# Altium project Little_Drone.PrjPcb
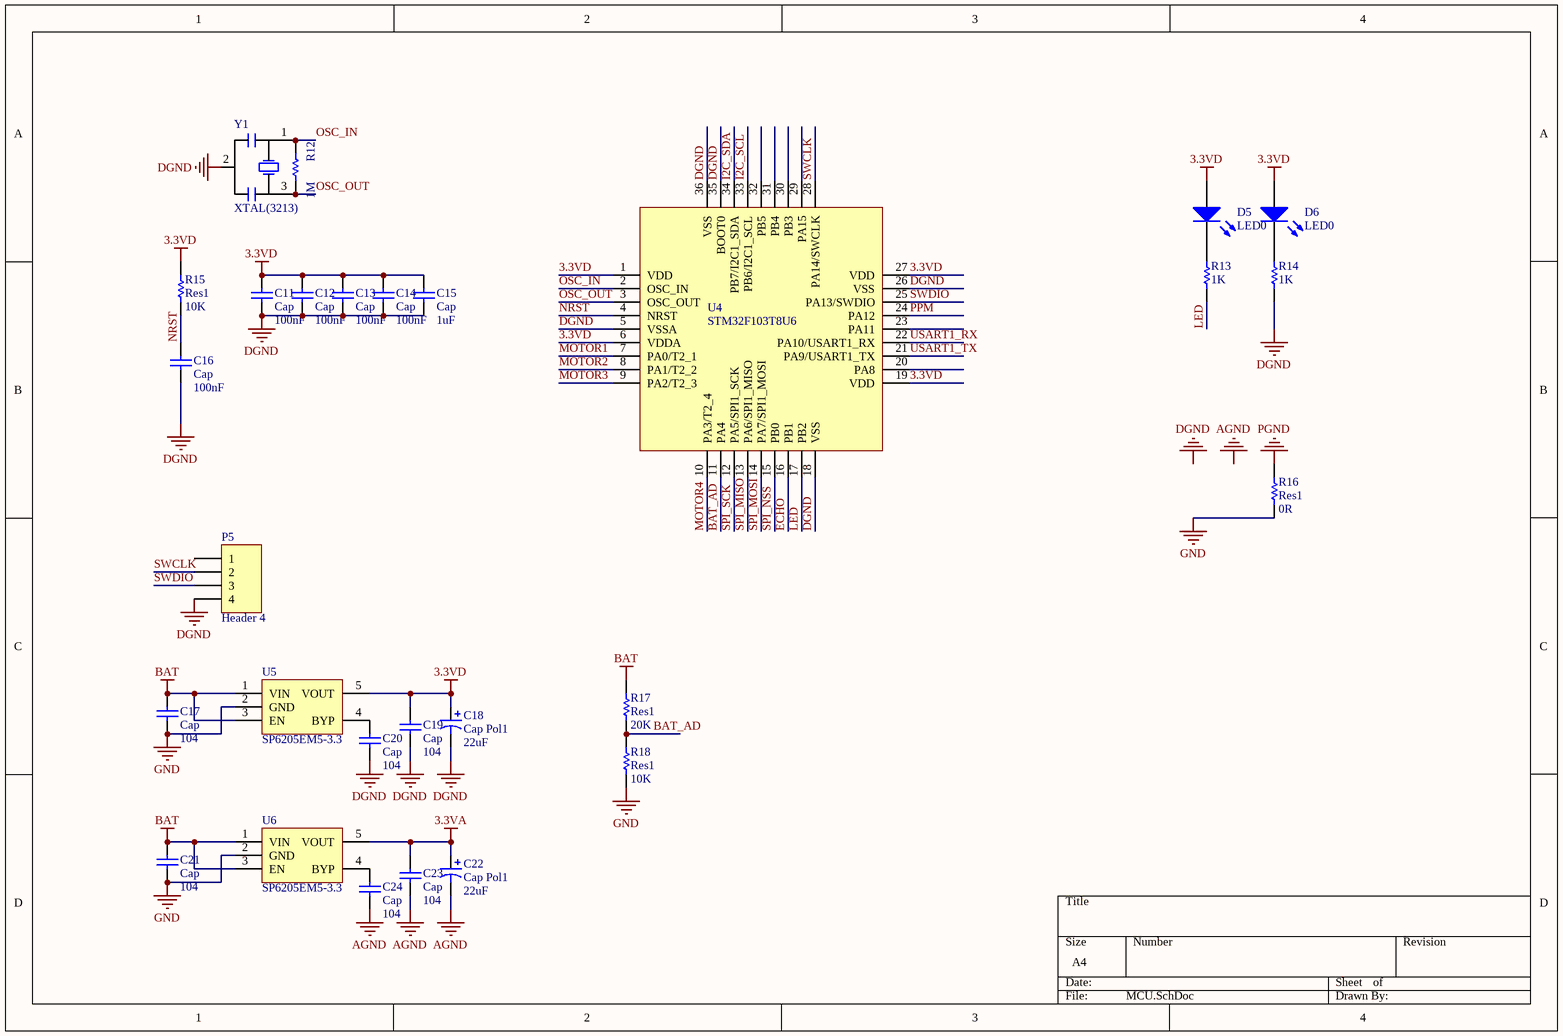
[diagram p0: MCU.SchDoc]
2 sheets, 64 parts. Net scope: global (net labels, ports and power ports of the same name join across sheets).
Board file: PCB.PcbDoc
Sheets:
  MCU.SchDoc
  MOTOR.SchDoc

## Sheet MCU.SchDoc
size A4

### Parts
(Parts that share a designator on the sheet are numbered #1, #2 ... from top to bottom, then left to right.)
C11  Cap  value 100nF  [C0402]
C12  Cap  value 100nF  [C0402]
C13  Cap  value 100nF  [C0402]
C14  Cap  value 100nF  [C0402]
C15  Cap  value 1uF  [C0402]
C16  Cap  value 100nF  [C0402]
C17  Cap  value 104  [C0603]
C18  Cap Pol1  value 22uF  [C0805]
C19  Cap  value 104  [C0402]
C20  Cap  value 104  [C0402]
C21  Cap  value 104  [C0603]
C22  Cap Pol1  value 22uF  [C0805]
C23#1  Cap  value 104  [C0402]
C24#1  Cap  value 104  [C0402]
D5#1  LED0  [0603D]
D6#1  LED0  [0603D]
P5  Header 4  [1.0*4PIN/SMD]
R12  value 1M  [R0402]  (hidden comment: Res1)
R13  value 1K  [R0603]  (hidden comment: Res1)
R14  value 1K  [R0603]  (hidden comment: Res1)
R15#1  Res1  value 10K  [R0402]
R16#1  Res1  value 0R  [0805R]
R17#1  Res1  value 20K  [R0402]
R18#1  Res1  value 10K  [R0402]
U4  STM32F103T8U6  [VFQFPN36]
U5  SP6205EM5-3.3  [SOT-23-5]
U6  SP6205EM5-3.3  [SOT-23-5]
Y1  XTAL(3213)  [Y3213]

### Nets
3.3VA: C22.1 C23#1.2 U6.5(VOUT)
3.3VD: C11.2 C12.2 C13.2 C14.2 C15.2 C18.1 C19.2 D5#1.1(A) D6#1.1(A) R15#1.2 U4.1(VDD) U4.6(VDDA) U4.19(VDD) U4.27(VDD) U5.5(VOUT)
AGND: C22.2 C23#1.1 C24#1.1
BAT: C17.2 C21.2 R17#1.2 U5.1(VIN) U5.3(EN) U6.1(VIN) U6.3(EN)
DGND: C11.1 C12.1 C13.1 C14.1 C15.1 C16.1 C18.2 C19.1 C20.1 P5.4 R14.2 U4.5(VSSA) U4.18(VSS) U4.26(VSS) U4.35(BOOT0) U4.36(VSS) Y1.2(GND)
GND: C17.1 C21.1 R16#1.1 R18#1.1 U5.2(GND) U6.2(GND)
PGND: R16#1.2
BAT_AD: R17#1.1 R18#1.2 U4.11(PA4)
ECHO: U4.16(PB1)
I2C_SCL: U4.33(PB6/I2C1_SCL)
I2C_SDA: U4.34(PB7/I2C1_SDA)
LED: R13.2 U4.17(PB2)
MOTOR1: U4.7(PA0/T2_1)
MOTOR2: U4.8(PA1/T2_2)
MOTOR3: U4.9(PA2/T2_3)
MOTOR4: U4.10(PA3/T2_4)
NRST: C16.2 R15#1.1 U4.4(NRST)
OSC_IN: R12.2 U4.2(OSC_IN) Y1.1(OSC1)
OSC_OUT: R12.1 U4.3(OSC_OUT) Y1.3(OSC2)
PPM: U4.24(PA12)
SPI_MISO: U4.13(PA6/SPI1_MISO)
SPI_MOSI: U4.14(PA7/SPI1_MOSI)
SPI_NSS: U4.15(PB0)
SPI_SCK: U4.12(PA5/SPI1_SCK)
SWCLK: P5.2 U4.28(PA14/SWCLK)
SWDIO: P5.3 U4.25(PA13/SWDIO)
USART1_RX: U4.22(PA10/USART1_RX)
USART1_TX: U4.21(PA9/USART1_TX)
NetC20_2: C20.2 U5.4(BYP)
NetC24#1_2: C24#1.2 U6.4(BYP)
NetD5#1_2: D5#1.2(K) R13.1
NetD6#1_2: D6#1.2(K) R14.1

Not connected (* = marked no-connect by the designer): P5 1; U4 20(PA8) 23(PA11) 29(PA15) 30(PB3) 31(PB4) 32(PB5)

### Notes on the sheet
- Labels drawn without touching a wire or pin: AGND, DGND

### Library data of the parts
C11-C17 C19-C21 C23#1 C24#1 = Cap: Capacitor; Published: 8-Jun-2000; LatestRevisionDate: 17-Jul-2002; LatestRevisionNote: Re-released for DXP Platform.; PackageReference: RAD-0.3; Publisher: Altium Limited
C18 C22 = Cap Pol1: Polarized Capacitor (Radial); Published: 8-Jun-2000; LatestRevisionDate: 17-Jul-2002; LatestRevisionNote: Re-released for DXP Platform.; PackageReference: RB7.6-15; Publisher: Altium Limited
D5#1 D6#1 = LED0: Typical INFRARED GaAs LED; Published: 8-Jun-2000; LatestRevisionDate: 08-Jul-2005; LatestRevisionNote: Mech Layer 1 removed.; PackageReference: LED-0; Publisher: Altium Limited; PackageDescription: LED; 2 Leads
P5 = Header 4: Header, 4-Pin; LatestRevisionDate: 17-Jul-2002; LatestRevisionNote: Re-released for DXP Platform.; Publisher: Altium Limited
R12-R14 R15#1 R16#1 R17#1 R18#1 = Res1: Resistor; Published: 8-Jun-2000; LatestRevisionDate: 17-Jul-2002; LatestRevisionNote: Re-released for DXP Platform.; PackageReference: AXIAL-0.3; Publisher: Altium Limited; PackageDescription: Axial Device, Thru-Hole; 2 Leads; 0.3 in Pin Spacing
U5 U6 = SP6205: AD3330
Y1 = XTAL(3213): Crystal Oscillator; Published: 8-Jun-2000; LatestRevisionDate: 17-Jul-2002; LatestRevisionNote: Re-released for DXP Platform.; PackageReference: R38; Publisher: Altium Limited

## Sheet MOTOR.SchDoc
size A4
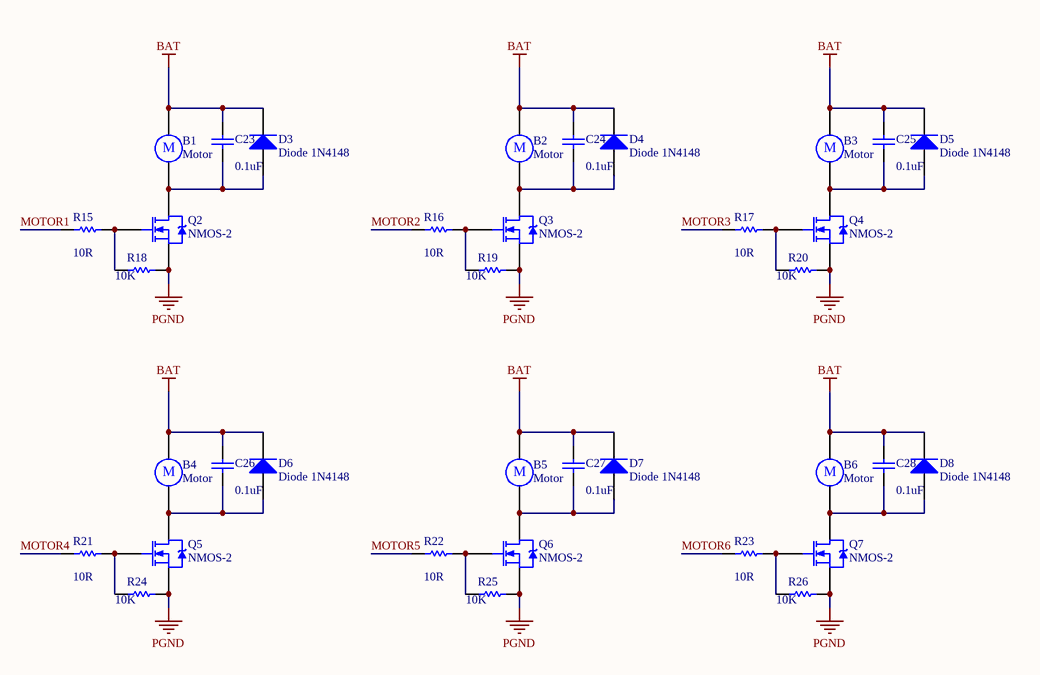
[diagram p1: MOTOR.SchDoc]

### Parts
(Parts that share a designator on the sheet are numbered #1, #2 ... from top to bottom, then left to right.)
B1  Motor  [MOTORPAD1]
B2  Motor  [MOTORPAD1]
B3  Motor  [MOTORPAD1]
B4  Motor  [MOTORPAD1]
B5  Motor  [MOTORPAD1]
B6  Motor  [MOTORPAD1]
C23#2  value 0.1uF  [c0603]  (hidden comment: Cap)
C24#2  value 0.1uF  [c0603]  (hidden comment: Cap)
C25  value 0.1uF  [c0603]  (hidden comment: Cap)
C26  value 0.1uF  [c0603]  (hidden comment: Cap)
C27  value 0.1uF  [c0603]  (hidden comment: Cap)
C28  value 0.1uF  [c0603]  (hidden comment: Cap)
D3  Diode 1N4148  [SOD-523]
D4  Diode 1N4148  [SOD-523]
D5#2  Diode 1N4148  [SOD-523]
D6#2  Diode 1N4148  [SOD-523]
D7  Diode 1N4148  [SOD-523]
D8  Diode 1N4148  [SOD-523]
Q2  NMOS-2  [WDFN8 3.3*3.3,0.65P]
Q3  NMOS-2  [WDFN8 3.3*3.3,0.65P]
Q4  NMOS-2  [WDFN8 3.3*3.3,0.65P]
Q5  NMOS-2  [WDFN8 3.3*3.3,0.65P]
Q6  NMOS-2  [WDFN8 3.3*3.3,0.65P]
Q7  NMOS-2  [WDFN8 3.3*3.3,0.65P]
R15#2  value 10R  [R0402]  (hidden comment: Res1)
R16#2  value 10R  [R0402]  (hidden comment: Res1)
R17#2  value 10R  [R0402]  (hidden comment: Res1)
R18#2  value 10K  [R0402]  (hidden comment: Res1)
R19  value 10K  [R0402]  (hidden comment: Res1)
R20  value 10K  [R0402]  (hidden comment: Res1)
R21  value 10R  [R0402]  (hidden comment: Res1)
R22  value 10R  [R0402]  (hidden comment: Res1)
R23  value 10R  [R0402]  (hidden comment: Res1)
R24  value 10K  [R0402]  (hidden comment: Res1)
R25  value 10K  [R0402]  (hidden comment: Res1)
R26  value 10K  [R0402]  (hidden comment: Res1)

### Nets
BAT: B1.1 B2.1 B3.1 B4.1 B5.1 B6.1 C23#2.2 C24#2.2 C25.2 C26.2 C27.2 C28.2 D3.2(K) D4.2(K) D5#2.2(K) D6#2.2(K) D7.2(K) D8.2(K)
PGND: Q2.2(S) Q3.2(S) Q4.2(S) Q5.2(S) Q6.2(S) Q7.2(S) R18#2.2 R19.2 R20.2 R24.2 R25.2 R26.2
MOTOR1: R15#2.1
MOTOR2: R16#2.1
MOTOR3: R17#2.1
MOTOR4: R21.1
MOTOR5: R22.1
MOTOR6: R23.1
NetB1_2: B1.2 C23#2.1 D3.1(A) Q2.3(D)
NetB2_2: B2.2 C24#2.1 D4.1(A) Q3.3(D)
NetB3_2: B3.2 C25.1 D5#2.1(A) Q4.3(D)
NetB4_2: B4.2 C26.1 D6#2.1(A) Q5.3(D)
NetB5_2: B5.2 C27.1 D7.1(A) Q6.3(D)
NetB6_2: B6.2 C28.1 D8.1(A) Q7.3(D)
NetQ2_1: Q2.1(G) R15#2.2 R18#2.1
NetQ3_1: Q3.1(G) R16#2.2 R19.1
NetQ4_1: Q4.1(G) R17#2.2 R20.1
NetQ5_1: Q5.1(G) R21.2 R24.1
NetQ6_1: Q6.1(G) R22.2 R25.1
NetQ7_1: Q7.1(G) R23.2 R26.1

### Notes on the sheet
- (in symbol Motor) M

### Library data of the parts
B1-B6 = Motor: Motor, General Kind; Published: 24-Mar-1999; LatestRevisionDate: 17-Jul-2002; LatestRevisionNote: Re-released for DXP Platform.; PackageReference: RB5-10.5; Publisher: Altium Limited
C23#2 C24#2 C25-C28 = Cap: Capacitor; Published: 8-Jun-2000; LatestRevisionDate: 17-Jul-2002; LatestRevisionNote: Re-released for DXP Platform.; PackageReference: RAD-0.3; Publisher: Altium Limited
D3 D4 D5#2 D6#2 D7 D8 = Diode 1N4148: High Conductance Fast Diode; Published: 8-Jun-2000; LatestRevisionDate: 17-Jul-2002; LatestRevisionNote: Re-released for DXP Platform.; DatasheetDocument: 1997; PackageReference: DO-35; Publisher: Altium Limited; Code_JEDEC: DO-204-AH; ComponentLink1Description: Manufacturer Link; ComponentLink1URL: http://www.fairchildsemi.com/; ComponentLink2Description: Datasheet; ComponentLink2URL: http://www.fairchildsemi.com/ds/1N%2F1N4148.pdf
Q2-Q7 = NMOS-2: N-Channel Power MOSFET; Note: Pin 2 is electrically connected to pin 4.; Published: 8-Jun-2000; LatestRevisionDate: 17-Jul-2002; LatestRevisionNote: Re-released for DXP Platform.; DatasheetDocument: PD-9.814; PackageReference: TO-220AB; Publisher: Altium Limited; Code_JEDEC: TO-220-AB; ComponentLink1Description: Manufacturer Link; ComponentLink1URL: http://www.irf.com/
R15#2 R16#2 R17#2 R18#2 R19-R26 = Res1: Resistor; Published: 8-Jun-2000; LatestRevisionDate: 17-Jul-2002; LatestRevisionNote: Re-released for DXP Platform.; PackageReference: AXIAL-0.3; Publisher: Altium Limited

## Nets that join several sheets
BAT: MCU (7 pins), MOTOR (18 pins)
PGND: MCU (R16#1.2), MOTOR (12 pins)
MOTOR1: MCU (U4.7), MOTOR (R15#2.1)
MOTOR2: MCU (U4.8), MOTOR (R16#2.1)
MOTOR3: MCU (U4.9), MOTOR (R17#2.1)
MOTOR4: MCU (U4.10), MOTOR (R21.1)